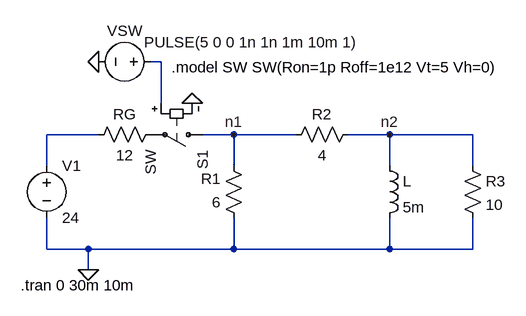
[diagram p0: schematic 2-1.asc]
2-1.asc, the LTspice schematic file:
Version 4.1
SHEET 1 880 680
WIRE 240 -64 224 -64
WIRE 240 0 240 -64
WIRE 144 48 64 48
WIRE 352 48 304 48
WIRE 448 48 352 48
WIRE 592 48 528 48
WIRE 720 48 592 48
WIRE 64 96 64 48
WIRE 352 96 352 48
WIRE 592 96 592 48
WIRE 720 96 720 48
WIRE 64 224 64 176
WIRE 128 224 64 224
WIRE 352 224 352 176
WIRE 352 224 128 224
WIRE 592 224 592 176
WIRE 592 224 352 224
WIRE 720 224 720 176
WIRE 720 224 592 224
WIRE 128 256 128 224
FLAG 352 48 n1
FLAG 592 48 n2
FLAG 128 256 0
FLAG 288 0 0
FLAG 144 -64 0
SYMBOL voltage 64 80 R0
SYMATTR InstName V1
SYMATTR Value 24
SYMBOL res 240 32 R90
WINDOW 0 0 56 VBottom 2
WINDOW 3 32 56 VTop 2
SYMATTR InstName RG
SYMATTR Value 12
SYMBOL res 368 192 R180
WINDOW 0 36 76 Left 2
WINDOW 3 36 40 Left 2
SYMATTR InstName R1
SYMATTR Value 6
SYMBOL res 544 32 R90
WINDOW 0 0 56 VBottom 2
WINDOW 3 32 56 VTop 2
SYMATTR InstName R2
SYMATTR Value 4
SYMBOL ind 576 80 R0
SYMATTR InstName L
SYMATTR Value 5m
SYMATTR SpiceLine Rser=1m
SYMBOL res 704 80 R0
SYMATTR InstName R3
SYMATTR Value 10
SYMBOL sw 320 48 R90
SYMATTR InstName S1
SYMBOL voltage 240 -64 R90
WINDOW 0 -32 56 VBottom 2
WINDOW 3 -46 -139 VTop 2
WINDOW 123 0 0 Left 0
WINDOW 39 0 0 Left 0
SYMATTR InstName VSW
SYMATTR Value PULSE(5 0 0 1n 1n 1m 10m 1)
TEXT 24 280 Left 2 !.tran 0 30m 10m
TEXT 256 -56 Left 2 !.model SW SW(Ron=1p Roff=1e12 Vt=5 Vh=0)

The netlist it stands for:
* 2-1.asc
V1 N002 0 24
RG P001 N002 12
R1 0 n1 6
R2 n2 n1 4
L n2 0 5m Rser=1m
R3 n2 0 10
S1 n1 P001 N001 0 SW
VSW N001 0 PULSE(5 0 0 1n 1n 1m 10m 1)
.tran 0 30m 10m
.model SW SW(Ron=1p Roff=1e12 Vt=5 Vh=0)
.backanno
.end

* Results of the author's LTspice run, read from the files saved beside the schematic
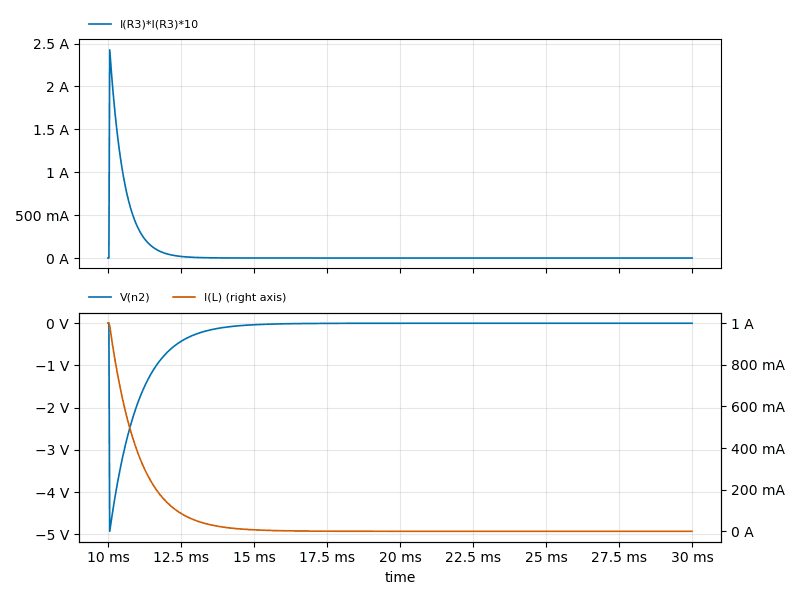
[diagram p1: Transient Analysis of 2-1.asc, plotted from the saved traces]
* Transient Analysis, 1 run:
*   I(R3)*I(R3)*10: min 0 A, max 2.426 A, average 62.43 mA, rms 279.2 mA, last 0 A
*   V(n2): min -4.925 V, max 2.639 mV, average -249.8 mV, rms 790.1 mV, last 0 V
*   I(L): min 0 A, max 999.5 mA, average 52.33 mA, rms 165.3 mA, last 0 A